# Altium project Arrax_testbench.PrjPcb (part 2 of 2)

## Sheet Thermocouples_1.SchDoc
size A; SheetNumber: 6; SheetTotal: 7
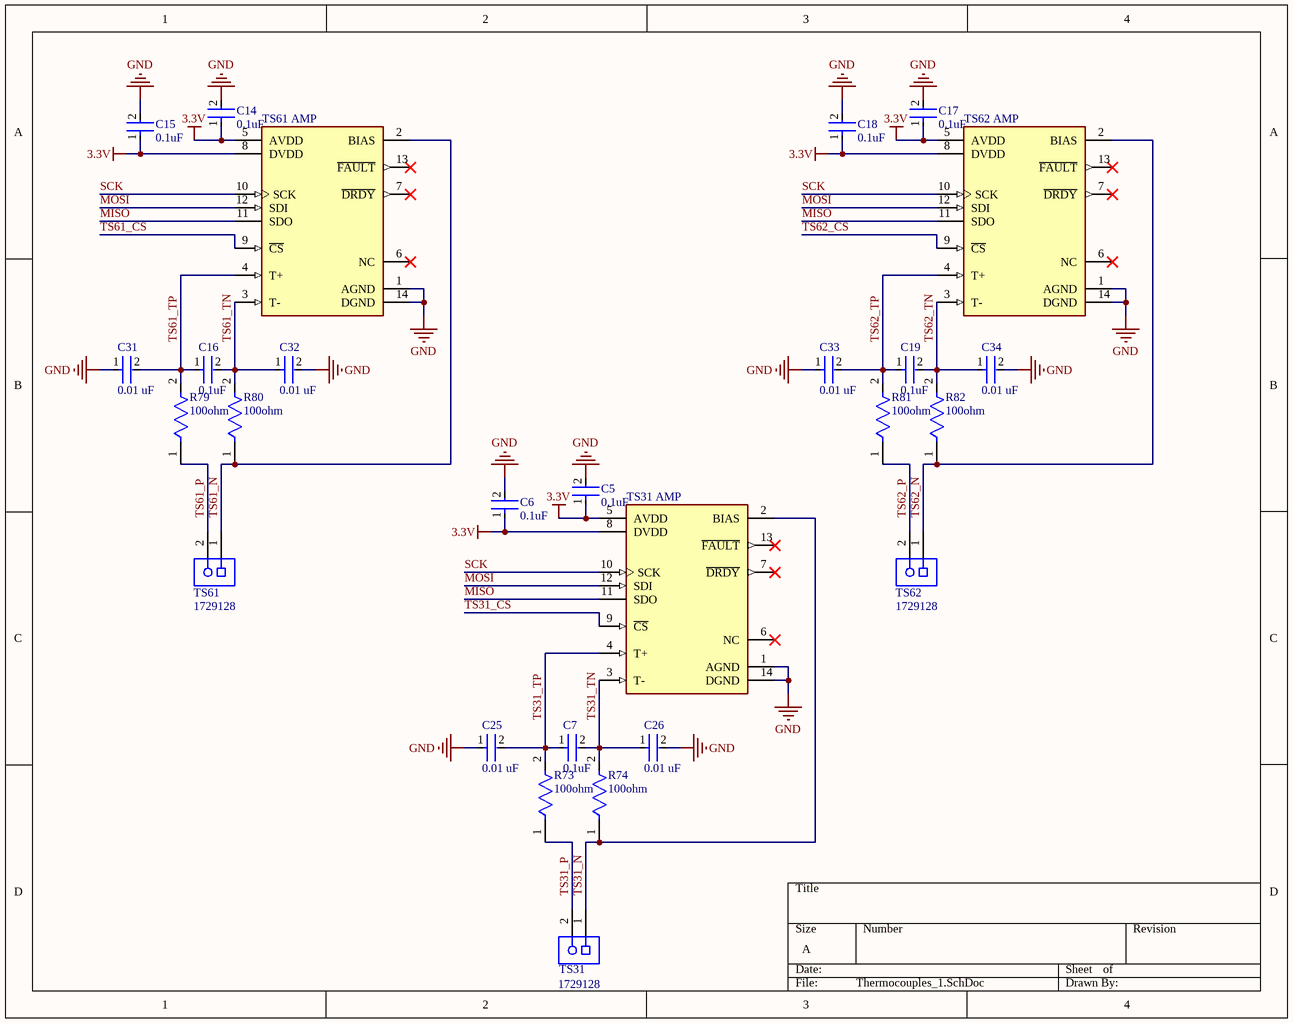
[diagram p5: Thermocouples_1.SchDoc]

### Parts
C5  0.1uF  [FP-CC0805-0_85-MFG]
C6  0.1uF  [FP-CC0805-0_85-MFG]
C7  0.1uF  [FP-CC0805-0_85-MFG]
C14  0.1uF  [FP-CC0805-0_85-MFG]
C15  0.1uF  [FP-CC0805-0_85-MFG]
C16  0.1uF  [FP-CC0805-0_85-MFG]
C17  0.1uF  [FP-CC0805-0_85-MFG]
C18  0.1uF  [FP-CC0805-0_85-MFG]
C19  0.1uF  [FP-CC0805-0_85-MFG]
C25  0.01 uF  [FP-CC0805-0_85-MFG]
C26  0.01 uF  [FP-CC0805-0_85-MFG]
C31  0.01 uF  [FP-CC0805-0_85-MFG]
C32  0.01 uF  [FP-CC0805-0_85-MFG]
C33  0.01 uF  [FP-CC0805-0_85-MFG]
C34  0.01 uF  [FP-CC0805-0_85-MFG]
R73  100ohm  [FP-RMCF0805-IPC_A]
R74  100ohm  [FP-RMCF0805-IPC_A]
R79  100ohm  [FP-RMCF0805-IPC_A]
R80  100ohm  [FP-RMCF0805-IPC_A]
R81  100ohm  [FP-RMCF0805-IPC_A]
R82  100ohm  [FP-RMCF0805-IPC_A]
TS31  1729128  [PHOE-1729128-2_V]
TS31_AMP  (no value)  [FP-U14-2-MFG]
TS61  1729128  [PHOE-1729128-2_V]
TS61_AMP  (no value)  [FP-U14-2-MFG]
TS62  1729128  [PHOE-1729128-2_V]
TS62_AMP  (no value)  [FP-U14-2-MFG]

### Nets
3.3V: C5.1 C6.1 C14.1 C15.1 C17.1 C18.1 TS31_AMP.5(AVDD) TS31_AMP.8(DVDD) TS61_AMP.5(AVDD) TS61_AMP.8(DVDD) TS62_AMP.5(AVDD) TS62_AMP.8(DVDD)
GND: C5.2 C6.2 C14.2 C15.2 C17.2 C18.2 C25.1 C26.2 C31.1 C32.2 C33.1 C34.2 TS31_AMP.1(AGND) TS31_AMP.14(DGND) TS61_AMP.1(AGND) TS61_AMP.14(DGND) TS62_AMP.1(AGND) TS62_AMP.14(DGND)
MISO: TS31_AMP.11(SDO) TS61_AMP.11(SDO) TS62_AMP.11(SDO)
MOSI: TS31_AMP.12(SDI) TS61_AMP.12(SDI) TS62_AMP.12(SDI)
SCK: TS31_AMP.10(SCK) TS61_AMP.10(SCK) TS62_AMP.10(SCK)
TS31_CS: TS31_AMP.9(~{CS})
TS31_N: R74.1 TS31.1 TS31_AMP.2(BIAS)
TS31_P: R73.1 TS31.2
TS31_TN: C7.2 C26.1 R74.2 TS31_AMP.3(T-)
TS31_TP: C7.1 C25.2 R73.2 TS31_AMP.4(T+)
TS61_CS: TS61_AMP.9(~{CS})
TS61_N: R80.1 TS61.1 TS61_AMP.2(BIAS)
TS61_P: R79.1 TS61.2
TS61_TN: C16.2 C32.1 R80.2 TS61_AMP.3(T-)
TS61_TP: C16.1 C31.2 R79.2 TS61_AMP.4(T+)
TS62_CS: TS62_AMP.9(~{CS})
TS62_N: R82.1 TS62.1 TS62_AMP.2(BIAS)
TS62_P: R81.1 TS62.2
TS62_TN: C19.2 C34.1 R82.2 TS62_AMP.3(T-)
TS62_TP: C19.1 C33.2 R81.2 TS62_AMP.4(T+)

Not connected (* = marked no-connect by the designer): TS31_AMP 6(NC)* 7(~{DRDY})* 13(~{FAULT})*; TS61_AMP 6(NC)* 7(~{DRDY})* 13(~{FAULT})*; TS62_AMP 6(NC)* 7(~{DRDY})* 13(~{FAULT})*

### Library data of the parts
C5-C7 C14-C19 = CMP-2100-03606-3: CAP CER 0.1UF 50V X7R 0805; Manufacturer Part Number: CC0805KRX7R9BB104; Manufacturer: Yageo; Tolerance: 0.1; Capacitance: 100 nF; Value: 100 nF; Material: Ceramic; Device Class L1: Passive Components; ComponentLink2Description: Datasheet; Package: CC0805-0.85; Digikey Description: CAP CER 0.1UF 50V X7R 0805; Device Class L3: Ceramic Capacitors; Temperature: -30°C to +85°C; Temperature Characteristic: X7R; Voltage Rating: 50 V; Height: 0.95mm; RoHS: TRUE; Ipc Land Pattern Name: CAPC200125X85; Device Class L2: Capacitors; Category: Cap; Temperature Range Low: -30°C; Temperature Range High: +85°C; Mouser Description: Multilayer Ceramic Capacitors MLCC - SMD/SMT 100nF 50V X7R 10%; Footprint Url: http://www.yageo.com/exep/pages/download/literatures/UPY-C_GEN_24.pdf; Automotive: No; Octopart: https://octopart.com/cc0805krx7r9bb104-yageo-192993; Lead Free: Yes; ComponentLink2URL: http://www.yageo.com/documents/recent/UPY-GPHC_Y5V_6.3V-to-50V_8.pdf
C25 C26 C31-C34 = CMP-1036-03842-3: CAP CER 10000PF 50V X7R 0805; Manufacturer: Yageo; Manufacturer Part Number: CC0805KRX7R9BB103; Capacitance: 10 nF; Material: Ceramic; Value: 10 nF; Tolerance: 0.1; Footprint Url: http://www.yageo.com/exep/pages/download/literatures/UPY-C_GEN_24.pdf; Temperature Characteristic: X7R; ComponentLink2Description: Datasheet; Lead Free: Yes; Height: 0.95mm; Temperature Range High: +85°C; Automotive: No; Octopart: https://octopart.com/cc0805krx7r9bb103-yageo-192989; Device Class L1: Passive Components; Mouser Description: Multilayer Ceramic Capacitors MLCC - SMD/SMT 10nF 50V X7R 10%; Temperature: -30°C to +85°C; Device Class L2: Capacitors; Ipc Land Pattern Name: CAPC200125X85; Device Class L3: Ceramic Capacitors; Temperature Range Low: -30°C; RoHS: TRUE; Voltage Rating: 50 V; Package: CC0805-0.85; Category: Cap; ComponentLink2URL: http://www.yageo.com/documents/recent/UPY-GPHC_Y5V_6.3V-to-50V_8.pdf; Digikey Description: CAP CER 10000PF 50V X7R 0805
R73 R74 R79-R82 = CMP-26527-001731-1: 100Ω ±1% 0.125W 0805 Thick Film Chip Resistor AEC-Q200 compliant; Power Rating: 250mW; Temperature Coefficient: 100ppm/°C; Resistance: 100R; Max Power Dissipation: 125mW; Radiation Hardening: No; RoHS Compliant: Yes; Case Code (Imperial): 0805; Depth: 1.25mm; Length: 2mm; Min Operating Temperature: -55°C; Series: RMCF; Packaging: Tape and Reel; Features: Automotive AEC-Q200; Height: 0.026inch; Size Code: 0805; Tolerance: 1%; Number of Terminations: 2; Max Operating Temperature: 155°C; Case/Package: 0805; Width: 0.049inch; Contact Plating: Tin; Resistor Type: Thick Film; Construction: Rectangular; Lead Free: Lead Free; Military Standard: Not; Case Code (Metric): 2012; Mount: Surface Mount
TS31 TS61 TS62 = CMP-2000-05815-1: PCB Terminal Block, 13.5 A, 400 V, 2-Pin THD, RoHS, Bulk; Manufacturer: Phoenix Contact; Package Version: 03/2015; No. of Rows: 1; Pitch: 5.08mm; No. of Positions: 2; Voltage Rating: 400V; Current Rating: 13500mA; Manufacturer URL: http://www.phoenixcontact.com/; Datasheet URL: https://datasheet.ciiva.com/16046/1729128-16046181.pdf; RoHS: TRUE; Package URL: https://www.phoenixcontact.com/online/portal/pi/pxc/product_detail_page/!ut/p/b1/3VdJjqNKFDxLH8AFycySyWY2ozFsEPOMMQaDOX1XedGL_1Vdm5YXJleknhSKeBkvI6EA8ncAo3AYoDhBQGco6KN7VURTdemj9us_IEKEZo_YHiPAEWEFmDGOHMORkqKYCORBZxgL7ZoaZYcbFFUZ3fqxSY6GOuxydWUuHqz1ynmMFygu583Bob0Ewr6Sd_l-5m-kAueHiB0jpRwZwe58wwtkpxtMYd_LmGcDRU02dRNEyWt6Y2ti5pSyJ_reIkzIulrqApdnbT11V5jnCKbYNCvhEM1MCpPByat_X379-iThf08CI5GfOPqfBeS3BRoBOdD55AKVv0iLwCMq-2BrzXWSGRH7pUGD9uwXQjiph3xL0DKQwdGa0JImiIOmBNOestqgwTHSSs2oOep-78apyXQBvNi8ZLaFjvjWvcaUEBu0MC6Wbe-d6mB0FAebo2lUWinqYaZs5DAYzV0RP9yitUjnGJ0iI9xhZkT42OCQNUJJhkgWINNQLP2JFP6OpMg3JCVg70jqHT0lvKOnhHf0lPuOnnLf0VPuWx6_dxwUIvwk5WMkT0kLL1mh61l2yZVSzG3pYV_bqo-mj6uMKwKwdnnW8Jh5RTOJzMOA5c-eJDaZQw4mTMPH02PvS_ZAqNVjVTo2WyYLkwH_KU1mmmG5kjRhDqPXLwwVHvVOjCM60-fpXvTDfMGW1PVFVS1r4e4yVDk4ZdNbkUHvqPqQSeian4UD39fNKmachqdJ1NJbyk8rXT9mXTvPk3oE5meulKGgiruPJek-4I9hTT6G8ZLOyRSm2RRVbThERQad5OS28hdt4YW4vG0stgYYzsWsK4_7y6DZMjJSCqri1kyiZR5vD7pwIrNR7QwPHTcLTI5qT7eRlpHrdGiupYlqQDJ7zy_CND8fWWBoLRXxk1RVcXiBQwbTD4Xi7KL-FuO94t9xaqweXzH; PartNumber: 1729128; Package Description: 2-Pin Through Hole Device, Body 8.1 x 10.16 mm, Pitch 5.08 mm; Datasheet Version: 12/2013; Mounting Technology: ThroughHole; Orientation: Horizontal; Package Reference: 1729128-2; Packing: Bulk
TS31_AMP TS61_AMP TS62_AMP = CMP-05687-000002-1: IC CONV THERMOCOUPLE 14TSSOP; Manufacturer Part Number: MAX31856MUD+T; Manufacturer: Maxim Electronics; Sensor Output: SPI; Max Junction Temp: +150°C; Min Supply Voltage: 3V; Standoff Height: 0.05mm; Max Supply Voltage: 3.6V; Nominal Supply Current: 1.2mA; Automotive: No; Temperature Range Low: -55°C; Device Class L3: Sensor and Detector Interfaces; Temperature Range High: +125°C; Package: U14-2; Sensor Type String: Thermocouple; Ipc Land Pattern Name: SOP65P640X110-14; Temperature: -55°C to +125°C; Device Class L1: Integrated Circuits (ICs); ComponentLink2Description: Datasheet; Digikey Description: IC CONV THERMOCOUPLE 14TSSOP; ComponentLink2URL: https://datasheets.maximintegrated.com/en/ds/MAX31856.pdf; RoHS: TRUE; Device Class L2: Interface ICs; Octopart: https://octopart.com/max31856mud%2Bt-maxim+integrated-51261112; Interface: SPI; Lead Free: Yes; Sensor Input: Thermocouple; Footprint Url: https://pdfserv.maximintegrated.com/land_patterns/90-0113.PDF; Height: 1.1mm; Category: IC

## Sheet Flow_sensors.SchDoc
size A; SheetNumber: 7; SheetTotal: 7
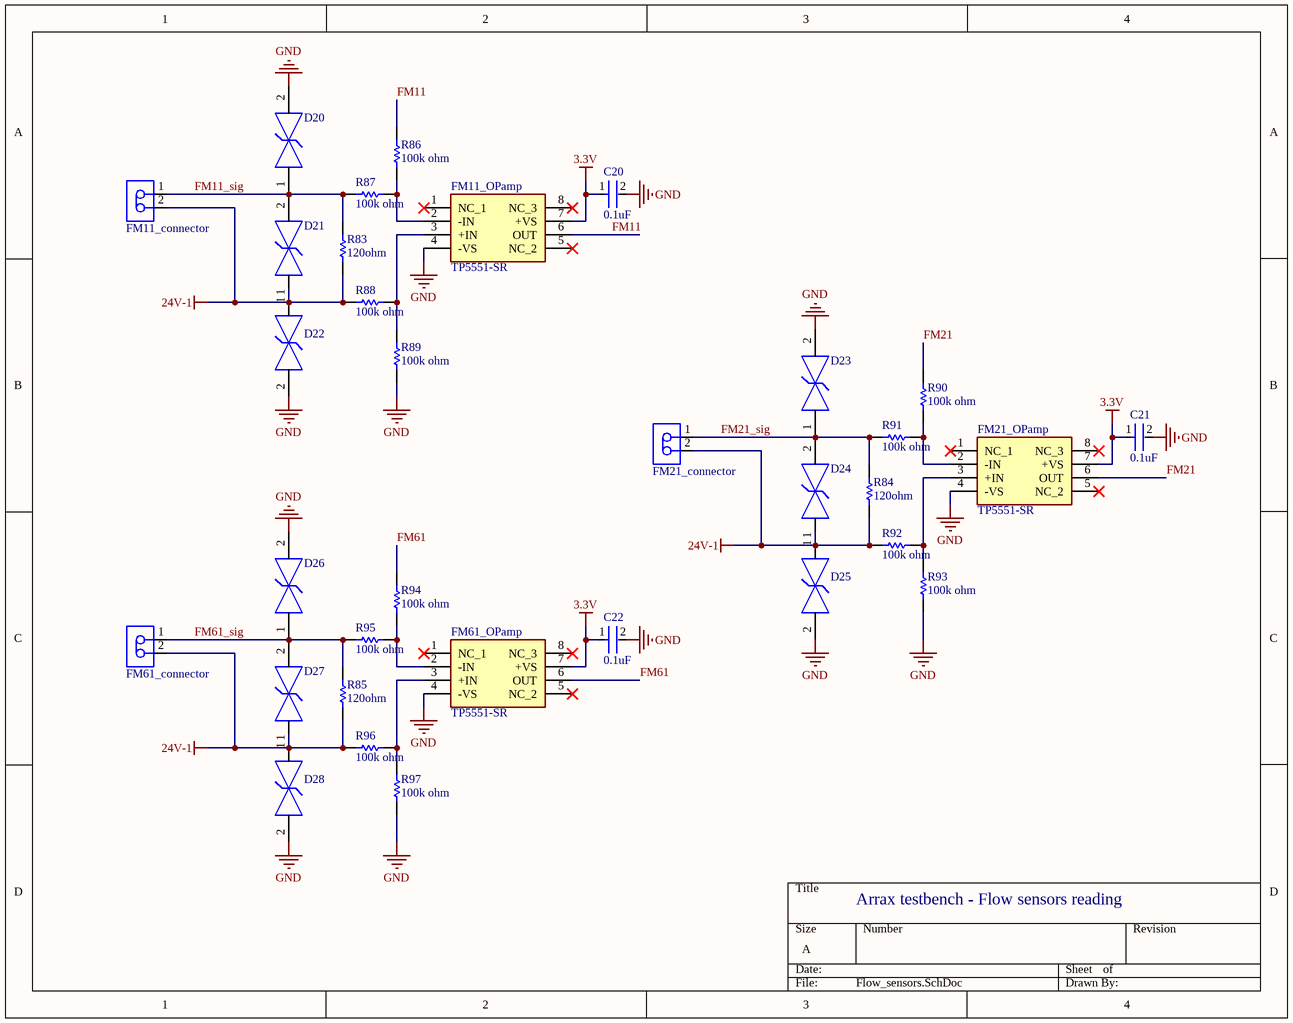
[diagram p6: Flow_sensors.SchDoc]

### Parts
C20  0.1uF  [FP-CC0805-0_85-MFG]
C21  0.1uF  [FP-CC0805-0_85-MFG]
C22  0.1uF  [FP-CC0805-0_85-MFG]
D20  SMBJ33CA-13-F  [FP-SMB-CA-MFG]  (value not drawn)
D21  SMBJ33CA-13-F  [FP-SMB-CA-MFG]  (value not drawn)
D22  SMBJ33CA-13-F  [FP-SMB-CA-MFG]  (value not drawn)
D23  SMBJ33CA-13-F  [FP-SMB-CA-MFG]  (value not drawn)
D24  SMBJ33CA-13-F  [FP-SMB-CA-MFG]  (value not drawn)
D25  SMBJ33CA-13-F  [FP-SMB-CA-MFG]  (value not drawn)
D26  SMBJ33CA-13-F  [FP-SMB-CA-MFG]  (value not drawn)
D27  SMBJ33CA-13-F  [FP-SMB-CA-MFG]  (value not drawn)
D28  SMBJ33CA-13-F  [FP-SMB-CA-MFG]  (value not drawn)
FM11_connector  640456-2  [TECO-640456-2_V]  (value not drawn)
FM11_OPamp  TP5551-SR  [SOIC127P600X175-8N]
FM21_connector  640456-2  [TECO-640456-2_V]  (value not drawn)
FM21_OPamp  TP5551-SR  [SOIC127P600X175-8N]
FM61_connector  640456-2  [TECO-640456-2_V]  (value not drawn)
FM61_OPamp  TP5551-SR  [SOIC127P600X175-8N]
R83  120ohm  [RESC2013X60X40ML20T25]
R84  120ohm  [RESC2013X60X40ML20T25]
R85  120ohm  [RESC2013X60X40ML20T25]
R86  100k ohm  [RESC2013X70X40ML20T20]
R87  100k ohm  [RESC2013X70X40ML20T20]
R88  100k ohm  [RESC2013X70X40ML20T20]
R89  100k ohm  [RESC2013X70X40ML20T20]
R90  100k ohm  [RESC2013X70X40ML20T20]
R91  100k ohm  [RESC2013X70X40ML20T20]
R92  100k ohm  [RESC2013X70X40ML20T20]
R93  100k ohm  [RESC2013X70X40ML20T20]
R94  100k ohm  [RESC2013X70X40ML20T20]
R95  100k ohm  [RESC2013X70X40ML20T20]
R96  100k ohm  [RESC2013X70X40ML20T20]
R97  100k ohm  [RESC2013X70X40ML20T20]

### Nets
3.3V: C20.1 C21.1 C22.1 FM11_OPamp.7(+VS) FM21_OPamp.7(+VS) FM61_OPamp.7(+VS)
24V-1: D21.1 D22.1 D24.1 D25.1 D27.1 D28.1 FM11_connector.2 FM21_connector.2 FM61_connector.2 R83.1 R84.1 R85.1 R88.2 R92.2 R96.1
GND: C20.2 C21.2 C22.2 D20.2 D22.2 D23.2 D25.2 D26.2 D28.2 FM11_OPamp.4(-VS) FM21_OPamp.4(-VS) FM61_OPamp.4(-VS) R89.1 R93.1 R97.1
FM11: FM11_OPamp.6(OUT) R86.2
FM11_sig: D20.1 D21.2 FM11_connector.1 R83.2 R87.2
FM21: FM21_OPamp.6(OUT) R90.2
FM21_sig: D23.1 D24.2 FM21_connector.1 R84.2 R91.2
FM61: FM61_OPamp.6(OUT) R94.2
FM61_sig: D26.1 D27.2 FM61_connector.1 R85.2 R95.1
NetFM11_OPamp_2: FM11_OPamp.2(-IN) R86.1 R87.1
NetFM11_OPamp_3: FM11_OPamp.3(+IN) R88.1 R89.2
NetFM21_OPamp_2: FM21_OPamp.2(-IN) R90.1 R91.1
NetFM21_OPamp_3: FM21_OPamp.3(+IN) R92.1 R93.2
NetFM61_OPamp_2: FM61_OPamp.2(-IN) R94.1 R95.2
NetFM61_OPamp_3: FM61_OPamp.3(+IN) R96.2 R97.2

Not connected (* = marked no-connect by the designer): FM11_OPamp 1(NC_1)* 5(NC_2)* 8(NC_3)*; FM21_OPamp 1(NC_1)* 5(NC_2)* 8(NC_3)*; FM61_OPamp 1(NC_1)* 5(NC_2)* 8(NC_3)*

### Notes on the sheet
- Arrax testbench - Flow sensors reading

### Library data of the parts
C20-C22 = CMP-2100-03606-3: as C5 on sheet Thermocouples_1; Device Class L1: Passive Components; ComponentLink2Description: Datasheet; Package: CC0805-0.85; Digikey Description: CAP CER 0.1UF 50V X7R 0805; Device Class L3: Ceramic Capacitors; Temperature: -30°C to +85°C; Temperature Characteristic: X7R; Voltage Rating: 50 V; Height: 0.95mm; RoHS: TRUE; Ipc Land Pattern Name: CAPC200125X85; Device Class L2: Capacitors; Category: Cap; Temperature Range Low: -30°C; Temperature Range High: +85°C; Mouser Description: Multilayer Ceramic Capacitors MLCC - SMD/SMT 100nF 50V X7R 10%; Footprint Url: http://www.yageo.com/exep/pages/download/literatures/UPY-C_GEN_24.pdf; Automotive: No; Octopart: https://octopart.com/cc0805krx7r9bb104-yageo-192993; Lead Free: Yes; ComponentLink2URL: http://www.yageo.com/documents/recent/UPY-GPHC_Y5V_6.3V-to-50V_8.pdf
D20-D28 = CMP-12828-000022-1: TVS DIODE 33V 53.3V SMB; Leakage Current: 5uA; ESD Protection: No; Element Configuration: Single; Direction: Bidirectional; Power Dissipation: 600W; Number of Elements: 1; Reverse Breakdown Voltage: 36.7V; Max Breakdown Voltage: 42.2V; Peak Pulse Current: 11.3A; Test Current: 1mA; Capacitance: 800pF; Case/Package: SMB; Contact Plating: Tin; Termination: SMD/SMT; Height: 2.62mm; Power Line Protection: No; Width: 3.9mm; Polarity: Bidirectional; Working Voltage: 33V; Packaging: Tape and Reel; Max Power Dissipation: 600W; Mount: Surface Mount; Min Operating Temperature: -55°C; Breakdown Voltage: 42.2V; Lead Free: Lead Free; Peak Pulse Power: 600W; Voltage Rating (DC): 33V; Max Reverse Leakage Current: 5uA; Max Output Current: 11.3A; Max Operating Temperature: 150°C; Package Quantity: 3000; Radiation Hardening: No; Number of Bidirectional Channels: 1; Min Breakdown Voltage: 36.7V; Length: 4.57mm; Clamping Voltage: 53.3V; Number of Pins: 2; Reverse Standoff Voltage: 33V; Max Surge Current: 11.3A; Composition: Zener
FM11_connector FM21_connector FM61_connector = CMP-2000-05417-1: Male Header, Pitch 2.54 mm, 1 x 2 Position, Height 10.49 mm, Tail Length 3.556 mm, -55 to 105 degC, RoHS, Bulk; Manufacturer: TE Connectivity; Standards: RoHSCompliant,ELVCompliant,UL94V-0; Material, Housing: Polyester; Agency Approvals: CSA,UL; Brand/Series: MTA-100Series; Contact Centerline Spacing: 0.100 / in.; Material, Contact: CopperAlloy; Current, Rating: 5 / A; Color, Housing: White; Contact Termination Area Plating: Tin; Special Features: Pinstrip; Number of Positions: 2; Pin Spacing: 0.1 / "; Temperature, Operating: -55to+105 / degC; Angle: Straight; Mount Angle: Vertical; Connector Type: MTA-100; Primary Type: InterconnectSystem; Voltage, Rating: 250 / V; Mounting Hole Size: 0.04 / "; Number of Rows: 1; Termination: Solder; Length, Terminal Post: 0.14 / in.; Manufacturer URL: http://www.te.com/; Color: White; Size, Post: 0.025 / in.; Contact Shape: Square; Mounting Type: PCMount; Datasheet URL: https://datasheet.ciiva.com/11746/0900766b80eb7fdd-11746365.pdf; Type: PCBPlug; Datasheet Version: Rev. W, 06/2004; Number of Contacts: 2; Flammability Rating: UL94V-0; Contact Plating: Tin; Length, Pin: 0.14 / "; Contact Mating Area Plating: Tin; Length, Overall: 0.2 / "
FM11_OPamp FM21_OPamp FM61_OPamp = TP5551-SR: Integrated Circuit; Manufacturer_Name: 3Peak Incorporated; Datasheet Link: http://file.3peakic.com.cn:8080/product/Datasheet_TP5551-TP5552-TP5554.pdf; Height: 1.75mm; Manufacturer_Part_Number: TP5551-SR
R83-R85 = CMP-2001-00588-1: Manufacturer: Panasonic; Part Number: ERA6AEB121V
R86-R97 = CMP-2001-04377-1: Part Number: ERJ-6ENF1003V; Manufacturer: Panasonic

## Nets that join several sheets
3.3V: Teensy_IOexp_valve_transitors (5 pins), Thermocouples (12 pins), Thermocouples_1 (12 pins), Flow_sensors (6 pins)
5V-1: Digpot_load_cell_alim (C36.2 LDO-1.5), Pressure_sensors (14 pins)
5V-2: Digpot_load_cell_alim (C38.2 LDO-2.5), Teensy_IOexp_valve_transitors (R.1)
24V-1: Digpot_load_cell_alim (24V-1.1 BC.7 Cin.2 LC01.4), Flow_sensors (15 pins)
24V-2: Digpot_load_cell_alim (24V-2.2), Teensy_IOexp_valve_transitors (12 pins), Valve_transistors (26 pins)
GND: Digpot_load_cell_alim (25 pins), Teensy_IOexp_valve_transitors (26 pins), Thermocouples (18 pins), Pressure_sensors (27 pins), Valve_transistors (39 pins), Thermocouples_1 (18 pins), Flow_sensors (15 pins)
5V_alim: Teensy_IOexp_valve_transitors (R.19), Pressure_sensors (R68.2 R69.1)
Digpot_CS: Digpot_load_cell_alim (Digipot.4), Teensy_IOexp_valve_transitors (L.4)
Extra_ADC: Teensy_IOexp_valve_transitors (R.18), Pressure_sensors (R53.1 R67.2)
FM11: Teensy_IOexp_valve_transitors (L.17), Flow_sensors (FM11_OPamp.6 R86.2)
FM21: Teensy_IOexp_valve_transitors (L.18), Flow_sensors (FM21_OPamp.6 R90.2)
FM61: Teensy_IOexp_valve_transitors (L.19), Flow_sensors (FM61_OPamp.6 R94.2)
Igniter: Digpot_load_cell_alim (R1.2 R2.2 T-Ign.1), Teensy_IOexp_valve_transitors (R.24)
LC01: Digpot_load_cell_alim (R54.1 R70.2), Teensy_IOexp_valve_transitors (L.16)
MISO: Teensy_IOexp_valve_transitors (IOexp.14 L.14), Thermocouples (TS11_AMP.11 TS41_AMP.11 TS42_AMP.11), Thermocouples_1 (TS31_AMP.11 TS61_AMP.11 TS62_AMP.11)
MOSI: Digpot_load_cell_alim (Digipot.3), Teensy_IOexp_valve_transitors (IOexp.13 L.13), Thermocouples (TS11_AMP.12 TS41_AMP.12 TS42_AMP.12), Thermocouples_1 (TS31_AMP.12 TS61_AMP.12 TS62_AMP.12)
Position_OK_L: Digpot_load_cell_alim (Actuator_L.3), Teensy_IOexp_valve_transitors (L.3)
Position_OK_R: Digpot_load_cell_alim (Actuator_R.3), Teensy_IOexp_valve_transitors (L.2)
PS11: Teensy_IOexp_valve_transitors (R.4), Pressure_sensors (R41.1 R55.2)
PS12: Teensy_IOexp_valve_transitors (R.5), Pressure_sensors (R42.1 R56.2)
PS21: Teensy_IOexp_valve_transitors (R.6), Pressure_sensors (R43.1 R57.2)
PS22: Teensy_IOexp_valve_transitors (R.7), Pressure_sensors (R44.1 R58.2)
PS31: Teensy_IOexp_valve_transitors (R.8), Pressure_sensors (R45.1 R59.2)
PS41: Teensy_IOexp_valve_transitors (R.9), Pressure_sensors (R46.1 R60.2)
PS42: Teensy_IOexp_valve_transitors (R.10), Pressure_sensors (R47.1 R61.2)
PS51: Teensy_IOexp_valve_transitors (R.11), Pressure_sensors (R48.1 R62.2)
PS61: Teensy_IOexp_valve_transitors (R.12), Pressure_sensors (R49.1 R63.2)
PS62: Teensy_IOexp_valve_transitors (R.13), Pressure_sensors (R50.1 R64.2)
PS63: Teensy_IOexp_valve_transitors (R.16), Pressure_sensors (R51.1 R65.2)
PS64: Teensy_IOexp_valve_transitors (R.17), Pressure_sensors (R52.1 R66.2)
SCK: Digpot_load_cell_alim (Digipot.2), Teensy_IOexp_valve_transitors (IOexp.12 R.14), Thermocouples (TS11_AMP.10 TS41_AMP.10 TS42_AMP.10), Thermocouples_1 (TS31_AMP.10 TS61_AMP.10 TS62_AMP.10)
SV13: Teensy_IOexp_valve_transitors (L.11), Valve_transistors (R7.2 R8.2 T-SV13.1)
SV24: Teensy_IOexp_valve_transitors (IOexp.23), Valve_transistors (R13.2 R14.2 T-SV24.1)
SV33: Teensy_IOexp_valve_transitors (IOexp.26), Valve_transistors (R19.2 R20.2 T-SV33.1)
SV34: Teensy_IOexp_valve_transitors (IOexp.27), Valve_transistors (R21.2 R22.2 T-SV34.1)
SV35: Teensy_IOexp_valve_transitors (IOexp.28), Valve_transistors (R23.2 R24.2 T-SV35.1)
SV36: Teensy_IOexp_valve_transitors (IOexp.1), Valve_transistors (R25.2 R26.2 T-SV36.1)
SV51: Teensy_IOexp_valve_transitors (IOexp.2), Valve_transistors (R27.2 R28.2 T-SV51.1)
SV52: Teensy_IOexp_valve_transitors (IOexp.3), Valve_transistors (R29.2 R30.2 T-SV52.1)
SV53: Teensy_IOexp_valve_transitors (IOexp.4), Valve_transistors (R31.2 R32.2 T-SV53.1)
SV61: Teensy_IOexp_valve_transitors (IOexp.5), Valve_transistors (R33.2 R34.2 T-SV61.1)
SV62: Teensy_IOexp_valve_transitors (IOexp.6), Valve_transistors (R35.2 R36.2 T-SV62.1)
SV63: Teensy_IOexp_valve_transitors (IOexp.7), Valve_transistors (R37.2 R38.2 T-SV63.1)
SVXX: Teensy_IOexp_valve_transitors (IOexp.8), Valve_transistors (R39.2 R40.2 T-SVXX.1)
TS11_CS: Teensy_IOexp_valve_transitors (L.20), Thermocouples (TS11_AMP.9)
TS31_CS: Teensy_IOexp_valve_transitors (L.21), Thermocouples_1 (TS31_AMP.9)
TS41_CS: Teensy_IOexp_valve_transitors (L.22), Thermocouples (TS41_AMP.9)
TS42_CS: Teensy_IOexp_valve_transitors (R.22), Thermocouples (TS42_AMP.9)
TS61_CS: Teensy_IOexp_valve_transitors (R.21), Thermocouples_1 (TS61_AMP.9)
TS62_CS: Teensy_IOexp_valve_transitors (R.20), Thermocouples_1 (TS62_AMP.9)